# Altium schematic sheet Sheet1.SchDoc
size A4
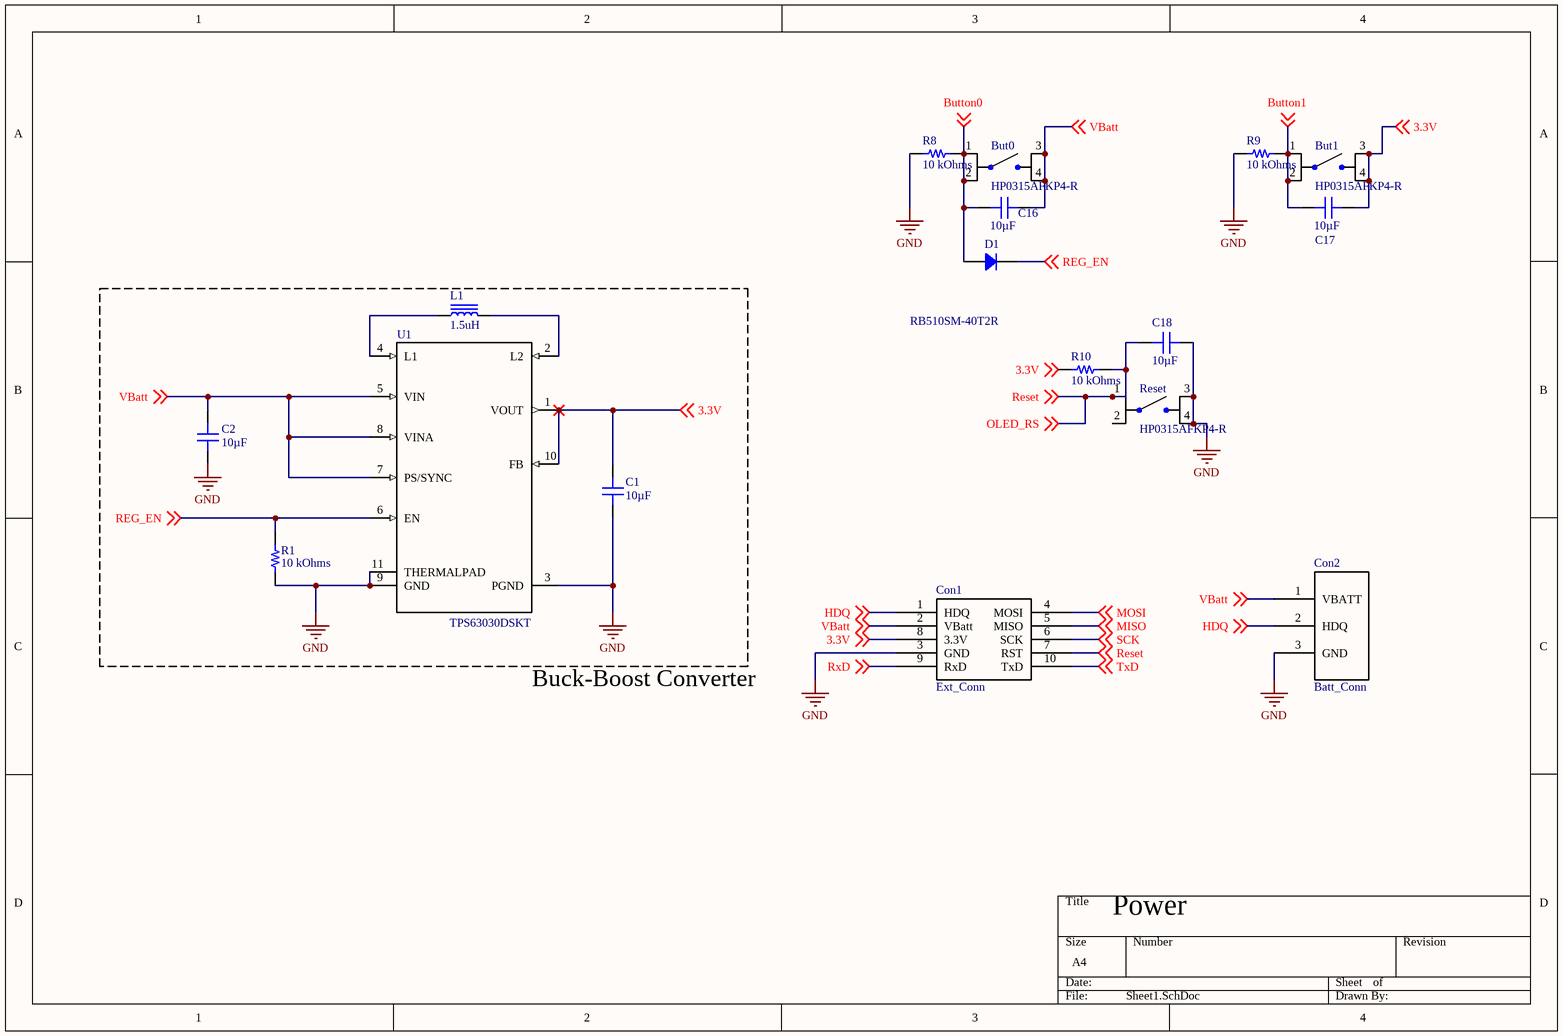
[diagram p0: Sheet1.SchDoc]

## Parts
But0  HP0315AFKP4-R  [*SW_HP0315AFKP4-R]
But1  HP0315AFKP4-R  [*SW_HP0315AFKP4-R]
C1  10µF  [CAP 0402_1005]
C2  10µF  [CAP 0402_1005]
C16  10µF  [CAP 0402_1005]
C17  10µF  [CAP 0402_1005]
C18  10µF  [CAP 0402_1005]
Con1  Ext_Conn  [JtagConn]
Con2  Batt_Conn  [BattConn]
D1  RB510SM-40T2R  [SOD-523]
L1  1.5uH  [TDK VLCF4028-2]
R1  10 kOhms  [RES 0402_1005]
R8  10 kOhms  [RES 0402_1005]
R9  10 kOhms  [RES 0402_1005]
R10  10 kOhms  [RES 0402_1005]
Reset  HP0315AFKP4-R  [*SW_HP0315AFKP4-R]
U1  TPS63030DSKT  [*SON50P260X260X80-11N]

## Nets
GND: C1.1 C2.1 C18.1 Con1.3(GND) Con2.3(GND) R1.1 R8.1 R9.2 Reset.3 Reset.4 U1.3(PGND) U1.9(GND) U1.11(THERMALPAD)
3.3V: But1.3 But1.4 C1.2 C17.1 Con1.8(3.3V) R10.2 U1.1(VOUT) U1.10(FB) ; off-sheet 3.3V
Button0: But0.1 But0.2 C16.2 D1.1 R8.2 ; off-sheet Button0
Button1: But1.1 But1.2 C17.2 R9.1 ; off-sheet Button1
HDQ: Con1.1(HDQ) Con2.2(HDQ) ; off-sheet HDQ
MISO: Con1.5(MISO) ; off-sheet MISO
MOSI: Con1.4(MOSI) ; off-sheet MOSI
OLED_RS: C18.2 Con1.7(RST) R10.1 Reset.1 ; off-sheet Reset, off-sheet OLED_RS  [also labelled Reset]
REG_EN: D1.2 R1.2 U1.6(EN) ; off-sheet REG_EN
RxD: Con1.9(RxD) ; off-sheet RxD
SCK: Con1.6(SCK) ; off-sheet SCK
TxD: Con1.10(TxD) ; off-sheet TxD
VBatt: But0.3 But0.4 C2.2 C16.1 Con1.2(VBatt) Con2.1(VBATT) U1.5(VIN) U1.7(PS/SYNC) U1.8(VINA) ; off-sheet VBatt
NetL1_1: L1.1 U1.4(L1)
NetL1_2: L1.2 U1.2(L2)

Not connected (* = marked no-connect by the designer): Reset 2

## Notes on the sheet
- Buck-Boost Converter
- Power

## Library data of the parts
But0 But1 Reset = HP0315AFKP4-R: Tactile Switch SPST-NO Top Actuated Surface Mount; MF: NKK Switches; MP: HP0315AFKP4-R; Availability: Unavailable; Package: None; SnapEDA_Link: https://www.snapeda.com/parts/HP0315AFKP4-R/NKK%20Switches/view-part/379626/?ref=snap; Price: None; Value: *
C1 C2 C16-C18 = CL05A106MP8NUB8: CAP CER 10UF 10V X5R 0402; Manufacturer: Samsung Electro-Mechanics; Tolerance: ±20%; Part Number: CL05A106MP8NUB8; Value: 10µF; Applications: General Purpose; Capacitance: 10µF; ComponentLink1Description: Datasheet; ComponentLink1URL: http://www.samsungsem.com/kr/support/product-search/mlcc/CL05A106MP8NUB8.jsp; ComponentLink2Description: DigiKey Link; ComponentLink2URL: http://digikey.com/product-detail/en/samsung-electro-mechanics/CL05A106MP8NUB8/1276-6830-1-ND/5961689; Device Package: 0402 (1005 Metric); LastUpdated: 19.01.2020 16:07:13; Lifecycle Status: Active; Minimum Order: 1; Mounting Type: Surface Mount, MLCC; Operating Temperature: -55°C ~ 85°C; Package / Case: 0402 (1005 Metric); Packaging: TapeAndReel; PartId: 1758; Part Status: Active; Price: 0.08; Series: CL; Size / Dimension: 0.039" L x 0.020" W (1.00mm x 0.50mm); Supplier 1: DigiKey; Supplier Part Number 1: 1276-6830-1-ND; Temperature Coefficient: X5R; Thickness (Max): 0.035" (0.90mm); Voltage - Rated: 10V
D1 = RB510SM-40T2R: RB510SM-40 IS LOW VF; Manufacturer: Rohm Semiconductor; Current - Average Rectified (Io): 100mA; Current - Reverse Leakage @ Vr: 2µA @ 40V; Diode Type: Schottky; Speed: Small Signal =< 200mA (Io), Any Speed; Voltage - DC Reverse (Vr) (Max): 40V; Voltage - Forward (Vf) (Max) @ If: 480mV @ 10mA; Part Number: RB510SM-40T2R; ComponentLink1Description: Datasheet; ComponentLink1URL: https://www.rohm.com/datasheet/RB510SM-40/rb510sm-40t2r-e; ComponentLink2Description: DigiKey Link; ComponentLink2URL: http://digikey.com/product-detail/en/rohm-semiconductor/RB510SM-40T2R/846-RB510SM-40T2RCT-ND/10670875; Device Package: SC-79, SOD-523; LastUpdated: 19.01.2020 16:25:52; Lifecycle Status: Active; Minimum Order: 1; Mounting Type: Surface Mount; Operating Temperature - Junction: 150°C (Max); Package / Case: SC-79, SOD-523; Packaging: Unknown; PartId: 2868; Part Status: Active; Price: 0.03; Series: -; Supplier 1: DigiKey; Supplier Part Number 1: 846-RB510SM-40T2RCT-ND; Supplier Device Package: EMD2
L1 = VLCF5028T-560MR43-2: FIXED IND 56UH 430MA 410 MOHM; Manufacturer: TDK Corporation; DC Resistance (DCR): 410mOhm Max; Inductance: 56µH; Inductance Frequency - Test: 100kHz; Material - Core: Ferrite; Shielding: Shielded; Tolerance: ±20%; Type: Wirewound; Value: 56µH; Part Number: VLCF5028T-560MR43-2; ComponentLink1Description: Datasheet; ComponentLink1URL: https://product.tdk.com/info/en/catalog/datasheets/inductor_commercial_power_vlcf5028-2_en.pdf?ref_disty=digikey; ComponentLink2Description: DigiKey Link; ComponentLink2URL: http://digikey.com/product-detail/en/tdk-corporation/VLCF5028T-560MR43-2/445-6567-1-ND/2465874; Current Rating (Amps): 430mA; Current - Saturation: 430mA; Device Package: Nonstandard; Height - Seated (Max): 0.110" (2.80mm); LastUpdated: 19.01.2020 16:24:51; Lifecycle Status: Active; Minimum Order: 1; Mounting Type: Surface Mount; Operating Temperature: -40°C ~ 105°C; Package / Case: Nonstandard; Packaging: TapeAndReel; PartId: 193; Part Status: Active; Price: 0.63; Series: VLCF; Size / Dimension: 0.197" L x 0.197" W (5.00mm x 5.00mm); Supplier 1: DigiKey; Supplier Part Number 1: 445-6567-1-ND
R1 R8-R10 = RP73PF1E10KBTD: RES 10K OHM 0.1% 1/10W 0402; Manufacturer: TE Connectivity Passive Product; Power (Watts): 0.1W, 1/10W; Temperature Coefficient: ±25ppm/°C; Part Number: RP73PF1E10KBTD; Value: 10 kOhms; ComponentLink1Description: Datasheet; ComponentLink1URL: https://www.te.com/commerce/DocumentDelivery/DDEController?Action=srchrtrv&DocNm=1773272&DocType=DS&DocLang=English; ComponentLink2Description: DigiKey Link; ComponentLink2URL: http://digikey.com/product-detail/en/te-connectivity-passive-product/RP73PF1E10KBTD/A127415CT-ND/8261381; Composition: Thin Film; Device Package: 0402 (1005 Metric); Height - Seated (Max): 0.014" (0.35mm); LastUpdated: 19.01.2020 16:11:48; Lifecycle Status: Active; Minimum Order: 1; Number of Terminations: 2; Operating Temperature: -55°C ~ 155°C; Package / Case: 0402 (1005 Metric); Packaging: TapeAndReel; PartId: 2434; Part Status: Active; Price: 0.08; Resistance: 10 kOhms; Series: RP73P, Holsworthy; Size / Dimension: 0.039" L x 0.020" W (1.00mm x 0.50mm); Supplier 1: DigiKey; Supplier Part Number 1: A127415CT-ND; Supplier Device Package: 0402; Tolerance: ±0.1%
U1 = TPS63030DSKT: Buck-Boost Switching Regulator IC Positive Adjustable 1.2V 1 Output 900mA _Switch_ 10-WFDFN Exposed Pad; MF: Texas Instruments; Package: SON-10 Texas Instruments; SnapEDA_Link: https://www.snapeda.com/parts/TPS63030DSKT/Texas%20Instruments/view-part/449700/?ref=snap; Price: None; MP: TPS63030DSKT; Availability: Unavailable; Value: *